# Altium project Motor.PrjPcb
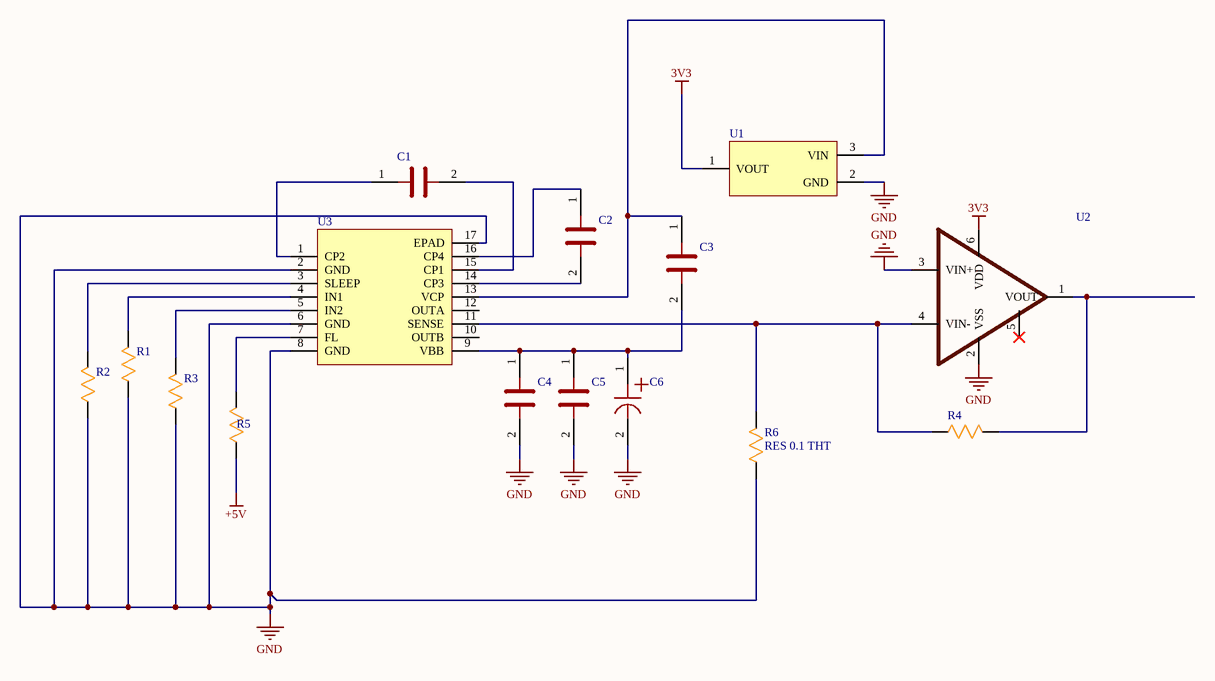
[diagram p0: Motor_K.SchDoc]
1 sheet, 15 parts. Net scope: global (net labels, ports and power ports of the same name join across sheets).
Board file: Motor_K.PcbDoc

## Sheet Motor_K.SchDoc
size A3; ApprovedBy: HARPİA; CheckedBy: BULUT HOCA; Revision: AA; SheetNumber: 1; SheetTotal: 1

### Parts
C1  CAP CER 0.1UF 10V X7R 0805  [CAP CER 0.1UF 10V X7R 0805]  (value not drawn)
C2  CAP CER 0.1UF 10V X7R 0805  [CAP CER 0.1UF 10V X7R 0805]  (value not drawn)
C3  CAP CER 0.1UF 10V X7R 0805  [CAP CER 0.1UF 10V X7R 0805]  (value not drawn)
C4  CAP CER 0.1UF 10V X7R 0805  [CAP CER 0.1UF 10V X7R 0805]  (value not drawn)
C5  CAP CER 10UF 10V X5R 0805  [CAP CER 10UF 10V X5R 0805]  (value not drawn)
C6  CAP ALUM 10UF 20% 10V SMD  [CAP ALUM 10UF 20% 10V SMD]  (value not drawn)
R1  RES 10K OHM 1% 1/8W 0805  [RES 10K OHM 1% 1/8W 0805]  (value not drawn)
R2  RES 10K OHM 1% 1/8W 0805  [RES 10K OHM 1% 1/8W 0805]  (value not drawn)
R3  RES 10K OHM 1% 1/8W 0805  [RES 10K OHM 1% 1/8W 0805]  (value not drawn)
R4  RES 10K OHM 1% 1/8W 0805  [RES 10K OHM 1% 1/8W 0805]  (value not drawn)
R5  RES 10K OHM 1% 1/8W 0805  [RES 10K OHM 1% 1/8W 0805]  (value not drawn)
R6  RES 0.1 THT  [111]
U1  Regülatör 3.3v 100mA SOT89 ST  [SOT89]  (value not drawn)
U2  IC Opamp GP 1 Circuit SOT23-6  [IC Opamp GP 1 Circuit SOT23-6]  (value not drawn)
U3  IC Motor Driver 2.5V-9V 16QFN  [IC Motor Driver 2.5V-9V]  (value not drawn)

### Nets
3V3: U1.1(VOUT) U2.6(VDD)
+5V: R5.1
GND: C4.2 C5.2 C6.2 R1.1 R2.1 R3.1 R6.1 U1.2(GND) U2.2(VSS) U2.3(VIN+) U3.2(GND) U3.6(GND) U3.8(GND) U3.17(EPAD)
NetC1_1: C1.1 U3.1(CP2)
NetC1_2: C1.2 U3.15(CP1)
NetC2_1: C2.1 U3.16(CP4)
NetC2_2: C2.2 U3.14(CP3)
NetC3_1: C3.1 U1.3(VIN) U3.13(VCP)
NetC3_2: C3.2 C4.1 C5.1 C6.1 U3.9(VBB)
NetR1_2: R1.2 U3.4(IN1)
NetR2_2: R2.2 U3.3(SLEEP)
NetR3_2: R3.2 U3.5(IN2)
NetR4_1: R4.1 R6.2 U2.4(VIN-) U3.11(SENSE)
NetR4_2: R4.2 U2.1(VOUT)
NetR5_2: R5.2 U3.7(FL)

Not connected (* = marked no-connect by the designer): U2 5(CS)*; U3 10(OUTB) 12(OUTA)

### Notes on the sheet
- DOSYA ADI / FILE NAME
- HAZIRLAYAN / PREPARED BY
- TANIM / DESCRIPTION
- YAYIN TARİHİ / REL. DATE
- KONTROL EDEN / CHECKED BY
- DEĞ. TARİHİ / CHANGE DATE
- ONAYLAYAN / APPROVED BY
- BÖLÜM / DEPARTMENT
- BOYUT / SIZE
- REVİZYON / REVISION
- SAYFA / SHEET
- /
- R&D- Hardware
- A3

### Library data of the parts
C1-C4 = 885012207016: Cap Ceramic 0.1uF 10V X7R 10% Pad SMD 0805 125C T/R; Manufacturer: Wurth Electronics; Material: 4241ConductorMaterial; Dielectric: 1511DielectricType; Insulation Resistance: 5GR; Designed by: ILKNUR; Supplier 1: Digikey; Manufacturer Part Number: 885012207016; RoHS: Yes; Category: Ceramic Capacitors; Stock 1: 16017; Pricing 1: 1=0,1, 10=0,047, 100=0,042, 500=0,037 (USD); Voltage Rating (DC): 10V; Height: 800um; ComponentLink1URL: http://www.farnell.com/datasheets/2031857.pdf?src-supplier=Farnell; ComponentLink1Description: http://www.farnell.com/datasheets/2031857.pdf?src-supplier=Farnell; ComponentLink2URL: https://katalog.we-online.de/pbs/datasheet/885012207016.pdf?src-supplier=Digikey; ComponentLink2Description: https://katalog.we-online.de/pbs/datasheet/885012207016.pdf?src-supplier=Digikey; ComponentLink3URL: http://www.farnell.com/datasheets/2031857.pdf?src-supplier=Newark; ComponentLink3Description: http://www.farnell.com/datasheets/2031857.pdf?src-supplier=Newark; Supplier Part Number 1: 732-8026-1-ND
C5 = CL21A106KPCLQNC: Multilayer Ceramic Capacitor, 10 uF, 10 V, ± 10%, X5R, 0805 [2012 Metric]; Manufacturer: Samsung; Material: 4241ConductorMaterial; Designed by: ILKNUR; Supplier 1: Digikey; Manufacturer Part Number: CL21A106KPCLQNC; RoHS: Yes; Category: Ceramic Capacitors; Stock 1: 737540; Pricing 1: 1=0,11, 10=0,077, 50=0,0462, 100=0,0364, 500=0,0269, 1000=0,02226 (USD); Voltage Rating (DC): 10V; ComponentLink1URL: https://datasheet.ciiva.com/25730/cl21a106kpclqnc-25730594.pdf?src-supplier=Digikey; ComponentLink1Description: https://datasheet.ciiva.com/25730/cl21a106kpclqnc-25730594.pdf?src-supplier=Digikey; Supplier Part Number 1: 1276-2402-1-ND
C6 = EEE-1AA100NR: Aluminum Electrolytic Capacitor, 10 uF, 10 V, ± 20%, 2000 hours @ 85°C, Radial Can - SMD; Manufacturer: Panasonic; Designed by: ILKNUR; Supplier 1: Digikey; Manufacturer Part Number: EEE-1AA100NR; RoHS: Yes; Category: Aluminum Electrolytic Capacitors; Stock 1: 25171; Pricing 1: 1=0,4, 10=0,265, 50=0,195, 100=0,1588, 500=0,12538, 1000=0,10587 (USD); Width: 650um; Lead Free: 5697LeadFree; ComponentLink1URL: https://datasheet.ciiva.com/14609/70255710-14609349.pdf?src-supplier=Allied+Electronics; ComponentLink1Description: https://datasheet.ciiva.com/14609/70255710-14609349.pdf?src-supplier=Allied+Electronics; ComponentLink2URL: https://datasheet.ciiva.com/24071/aba0000ce2-40801-24071897.pdf?src-supplier=Mouser; ComponentLink2Description: https://datasheet.ciiva.com/24071/aba0000ce2-40801-24071897.pdf?src-supplier=Mouser; ComponentLink3URL: https://datasheet.ciiva.com/11681/aba0000ce2-11681130.pdf?src-supplier=Avnet; ComponentLink3Description: https://datasheet.ciiva.com/11681/aba0000ce2-11681130.pdf?src-supplier=Avnet; Supplier Part Number 1: PCE4288CT-ND
R1-R5 = RC0805FR-0710KL: SMD Chip Resistor, 10 kOhm, ± 1%, 125 mW, 0805 [2012 Metric], Thick Film, General Purpose; Manufacturer: Yageo; Resistance: 10kR; Temperature Coefficient: 100ppm/°C; Power Rating: 125mW; Voltage Rating: 150V; Designed by: ILKNUR; Supplier 1: Digikey; Manufacturer Part Number: RC0805FR-0710KL; RoHS: Yes; Category: Chip SMD Resistors; Stock 1: 2341548; Pricing 1: 1=0,1, 10=0,027, 50=0,017, 100=0,0142, 500=0,00976, 1000=0,00844 (USD); Case/Package: 0805; Case Code (Imperial): 0805; Case Code (Metric): 2012; Size Code: 0805; Min Operating Temperature: -55°C; Max Operating Temperature: 155°C; Tolerance: 1%; Packaging: Tape and Reel; Resistor Type: Thick Film; Package Quantity: 1; Termination: SMD/SMT; Number of Terminations: 2; Max Power Dissipation: 125mW; Features: Moisture Resistant; Series: RC; Construction: Rectangular; Resistance Tolerance: 1%; Voltage Rating (AC): 150V; Technology: THICK FILM; Length: 0.079inch; Width: 0.049inch; Height: 0.024inch; Depth: 1.25mm; Lead Free: Lead Free; Reach SVHC Compliant: Unknown; Military Standard: Not; RoHS Compliant: Yes; Supplier Part Number 1: 311-10.0KCRCT-ND
R6 = LR1LJR10: Resistors Metal Film Res 0.1 Ohms Pwr-Rtg 0.5 W Tol 5%Axial LR Neohm Series; Manufacturer: TE Connectivity; Manufacturer Part Number: 1622598-1; Designed by: ILKNUR; Supplier 1: Digikey; RoHS: Yes; Stock 1: 268609; Pricing 1: 1=0,33, 10=0,238, 25=0,1912, 50=0,142, 100=0,1001, 250=0,0892, 500=0,07644, 1000=0,06409 (USD); ComponentLink1URL: https://datasheet.ciiva.com/6536/eng-ds-1773241-g-6536220.pdf?src-supplier=Digikey; ComponentLink1Description: https://datasheet.ciiva.com/6536/eng-ds-1773241-g-6536220.pdf?src-supplier=Digikey; Supplier Part Number 1: A105964CT-ND
U1 = Regülatör 3.3v 100mA SOT89 ST: Linear Voltage Regulator IC Positive Fixed 1 Output 3.3V 100mA SOT-89-3; Manufacturer: STMicroelectronics; Manufacturer Part Number: L78L33ABUTR; Designed by: ILKNUR; Supplier 1: Digikey; RoHS: Yes; Category: Voltage Regulators - Linear; Stock 1: 190748; Pricing 1: 1=0,4, 10=0,346, 25=0,3232, 100=0,2587, 250=0,24024, 500=0,20326, 1000=0,15707 (USD); ComponentLink1URL: https://datasheet.ciiva.com/7992/1868798-7992604.pdf?src-supplier=Element14; ComponentLink1Description: https://datasheet.ciiva.com/7992/1868798-7992604.pdf?src-supplier=Element14; ComponentLink2URL: https://datasheet.ciiva.com/4882/cd00000446-4882143.pdf?src-supplier=Mouser; ComponentLink2Description: https://datasheet.ciiva.com/4882/cd00000446-4882143.pdf?src-supplier=Mouser; ComponentLink3URL: https://datasheet.ciiva.com/2041/cd00000446-2041996.pdf?src-supplier=Digikey; ComponentLink3Description: https://datasheet.ciiva.com/2041/cd00000446-2041996.pdf?src-supplier=Digikey; ComponentLink4URL: https://datasheet.ciiva.com/2041/cd00000446-2041997.pdf?src-supplier=Digikey; ComponentLink4Description: https://datasheet.ciiva.com/2041/cd00000446-2041997.pdf?src-supplier=Digikey; ComponentLink5URL: https://datasheet.ciiva.com/2041/cd00000446-2041998.pdf?src-supplier=Digikey; ComponentLink5Description: https://datasheet.ciiva.com/2041/cd00000446-2041998.pdf?src-supplier=Digikey; ComponentLink6URL: https://datasheet.ciiva.com/16443/cd00000446-16443399.pdf?src-supplier=Future+Electronics; ComponentLink6Description: https://datasheet.ciiva.com/16443/cd00000446-16443399.pdf?src-supplier=Future+Electronics; Supplier Part Number 1: 497-7286-1-ND
U2 = IC Opamp GP 1 Circuit SOT23-6: MCP6043 Series 6 V 14 kHz Rail-to-Rail I/O Operational Amplifier -SOT-23-6; Manufacturer: Microchip; Manufacturer Part Number: MCP6043T-E/CH; Designed by: ILKNUR; Supplier 1: Digikey; RoHS: Yes; Category: Amplifiers - Op Amps, Buffer, Instrumentation; Stock 1: 12673; Pricing 1: 1=0,78, 25=0,66, 100=0,58 (USD); ComponentLink1URL: https://datasheet.ciiva.com/11706/jp014787-11706955.pdf?src-supplier=Avnet; ComponentLink1Description: https://datasheet.ciiva.com/11706/jp014787-11706955.pdf?src-supplier=Avnet; ComponentLink2URL: https://datasheet.ciiva.com/1804/21669c-1804960.pdf?src-supplier=Digikey; ComponentLink2Description: https://datasheet.ciiva.com/1804/21669c-1804960.pdf?src-supplier=Digikey; ComponentLink3URL: https://datasheet.ciiva.com/16450/filehandler-aspxddocname-en014787-16450540.pdf?src-supplier=Future+Electronics; ComponentLink3Description: https://datasheet.ciiva.com/16450/filehandler-aspxddocname-en014787-16450540.pdf?src-supplier=Future+Electronics; Supplier Part Number 1: MCP6043T-E/CHCT-ND
U3 = IC Motor Driver 2.5V-9V 16QFN: 1A Brush DC Motor 2.5V~9V Parallel QFN-16-EP(3x3) Motor Driver ICs ROHS; Manufacturer: Allegro MicroSystems; Manufacturer Part Number: A3918SESTR-T; Number of Outputs: 1; Min Supply Voltage: 2.5V; Max Supply Voltage: 9V; Designed by: ILKNUR; Supplier 1: Digikey; RoHS: Yes; Category: Interface ICs; Stock 1: 21815; Pricing 1: 1=1,53, 10=1,371, 25=1,3008, 100=1,0686, 250=0,99888, 500=0,88274 (USD); Mount: Surface Mount; Case/Package: QFN; Number of Pins: 16; Min Operating Temperature: -20°C; Max Operating Temperature: 150°C; Package Quantity: 1; Packaging: Tape and Reel; Output Current: 1A; Series: -; Interface: Parallel; Technology: DMOS; RoHS Compliant: Yes; ComponentLink1URL: https://datasheet.ciiva.com/6609/a3918-datasheet-6609082.pdf?src-supplier=Digikey; ComponentLink1Description: https://datasheet.ciiva.com/6609/a3918-datasheet-6609082.pdf?src-supplier=Digikey; Supplier Part Number 1: 620-1476-1-ND